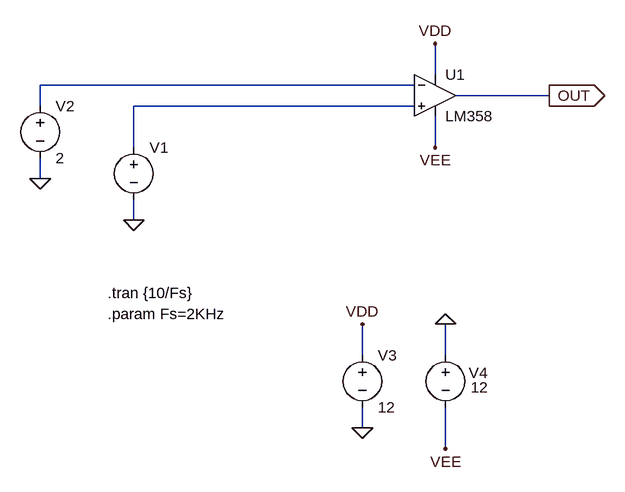
[diagram p0: schematic v1.0.asc]
v1.0.asc, the LTspice schematic file:
Version 4.1
SHEET 1 880 696
WIRE 544 32 544 -16
WIRE 512 48 -64 48
WIRE 720 64 576 64
WIRE -64 80 -64 48
WIRE 512 80 80 80
WIRE 80 144 80 80
WIRE 544 144 544 96
WIRE -64 192 -64 160
WIRE 80 256 80 224
WIRE 432 464 432 416
WIRE 560 464 560 416
WIRE 432 576 432 544
WIRE 560 608 560 544
FLAG 80 256 0
FLAG -64 192 0
FLAG 432 576 0
FLAG 560 416 0
FLAG 432 416 VDD
FLAG 560 608 VEE
FLAG 544 144 VEE
FLAG 544 -16 VDD
FLAG 720 64 OUT
IOPIN 720 64 Out
SYMBOL voltage 80 128 R0
WINDOW 3 41 64 Invisible 2
WINDOW 123 0 0 Left 0
WINDOW 39 0 0 Left 0
SYMATTR InstName V1
SYMATTR Value PULSE(0 5 0 {(1/Fs)-2n} 1n 1n {1/Fs})
SYMBOL MyLib\\OpAmp\\LM358 544 0 R0
SYMATTR InstName U1
SYMBOL voltage -64 64 R0
WINDOW 123 0 0 Left 0
WINDOW 39 0 0 Left 0
SYMATTR InstName V2
SYMATTR Value 2
SYMBOL voltage 432 448 R0
WINDOW 123 0 0 Left 0
WINDOW 39 0 0 Left 0
SYMATTR InstName V3
SYMATTR Value 12
SYMBOL voltage 560 448 R0
WINDOW 0 36 43 Left 2
WINDOW 3 39 65 Left 2
WINDOW 123 0 0 Left 0
WINDOW 39 0 0 Left 0
SYMATTR InstName V4
SYMATTR Value 12
TEXT 40 400 Left 2 !.param Fs=2KHz
TEXT 40 368 Left 2 !.tran {10/Fs}

The netlist it stands for:
* v1.0.asc
V1 N002 0 PULSE(0 5 0 {(1/Fs)-2n} 1n 1n {1/Fs})
* U1: LM358 (symbol MyLib\OpAmp\LM358 not available, pins judged from their places): In+=N002 In-=N001 V+=VDD V-=VEE OUT=OUT
V2 N001 0 2
V3 VDD 0 12
V4 0 VEE 12
.param Fs=2KHz
.tran {10/Fs}
.backanno
.end